# EAGLE design AODC v1 (EAGLE 6.1)
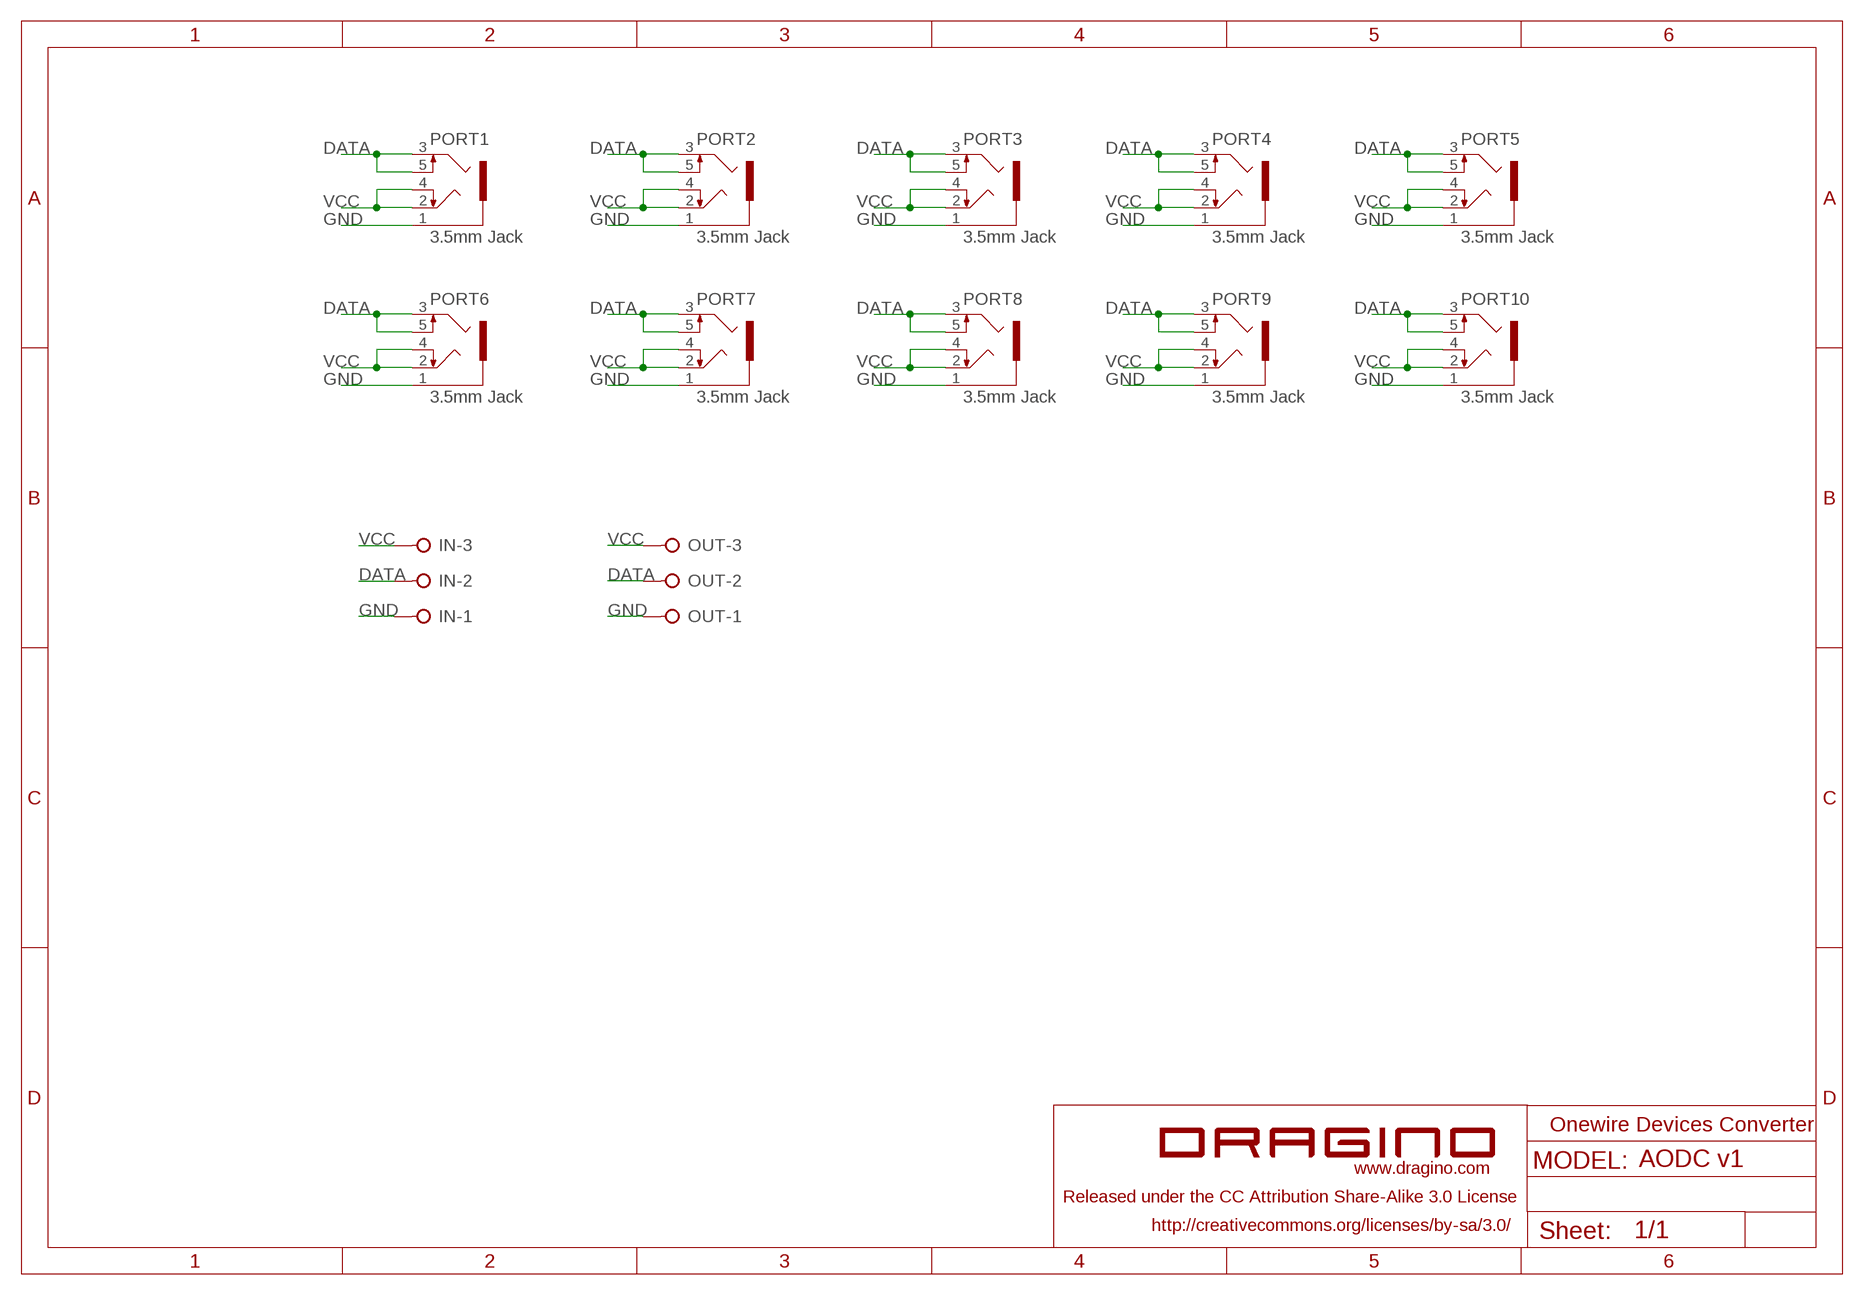
[diagram p0: schematic, sheet 1]

## Parts
IN  SCREW-TERMINAL-3P  [W237-3E]
OUT  SCREW-TERMINAL-3P  [W237-3E]
PORT1  3.5mm Jack  AUDIO-JACK-3.5MMAUDIO-3.5MM  [AUDIO-JACK-3.5MM]
PORT2  3.5mm Jack  AUDIO-JACK-3.5MMAUDIO-3.5MM  [AUDIO-JACK-3.5MM]
PORT3  3.5mm Jack  AUDIO-JACK-3.5MMAUDIO-3.5MM  [AUDIO-JACK-3.5MM]
PORT4  3.5mm Jack  AUDIO-JACK-3.5MMAUDIO-3.5MM  [AUDIO-JACK-3.5MM]
PORT5  3.5mm Jack  AUDIO-JACK-3.5MMAUDIO-3.5MM  [AUDIO-JACK-3.5MM]
PORT6  3.5mm Jack  AUDIO-JACK-3.5MMAUDIO-3.5MM  [AUDIO-JACK-3.5MM]
PORT7  3.5mm Jack  AUDIO-JACK-3.5MMAUDIO-3.5MM  [AUDIO-JACK-3.5MM]
PORT8  3.5mm Jack  AUDIO-JACK-3.5MMAUDIO-3.5MM  [AUDIO-JACK-3.5MM]
PORT9  3.5mm Jack  AUDIO-JACK-3.5MMAUDIO-3.5MM  [AUDIO-JACK-3.5MM]
PORT10  3.5mm Jack  AUDIO-JACK-3.5MMAUDIO-3.5MM  [AUDIO-JACK-3.5MM]
U$1  LOGO-SILK  [LOGO-SILK-15MM]

## Nets
DATA: IN.2 OUT.2 PORT1.3 PORT1.5 PORT2.3 PORT2.5 PORT3.3 PORT3.5 PORT4.3 PORT4.5 PORT5.3 PORT5.5 PORT6.3 PORT6.5 PORT7.3 PORT7.5 PORT8.3 PORT8.5 PORT9.3 PORT9.5 PORT10.3 PORT10.5
GND: IN.1 OUT.1 PORT1.1 PORT2.1 PORT3.1 PORT4.1 PORT5.1 PORT6.1 PORT7.1 PORT8.1 PORT9.1 PORT10.1
VCC: IN.3 OUT.3 PORT1.2 PORT1.4 PORT2.2 PORT2.4 PORT3.2 PORT3.4 PORT4.2 PORT4.4 PORT5.2 PORT5.4 PORT6.2 PORT6.4 PORT7.2 PORT7.4 PORT8.2 PORT8.4 PORT9.2 PORT9.4 PORT10.2 PORT10.4

## Notes on the sheet
- Onewire Devices Converter

## Library data of the parts
IN OUT = dragino:SCREW-TERMINAL-3P: WAGO SREW CLAMP; OC_FARNELL: unknown; OC_NEWARK: unknown
PORT1-PORT10 = dragino:AUDIO-JACK-3.5MM
U$1 = dragino:LOGO-SILK: LOGO for Dragino

## Net classes
0 default: width 0.254 mm, clearance 0.254 mm
1 power: width 0.61 mm, drill 0.61 mm, clearance 0.254 mm
2 gnd: width 0.305 mm, drill 0.381 mm, clearance 0.254 mm
3 usbvcc: width 0.508 mm, drill 0.61 mm, clearance 0.254 mm
4 aref: width 0.406 mm, drill 0.61 mm, clearance 0.254 mm

## Board
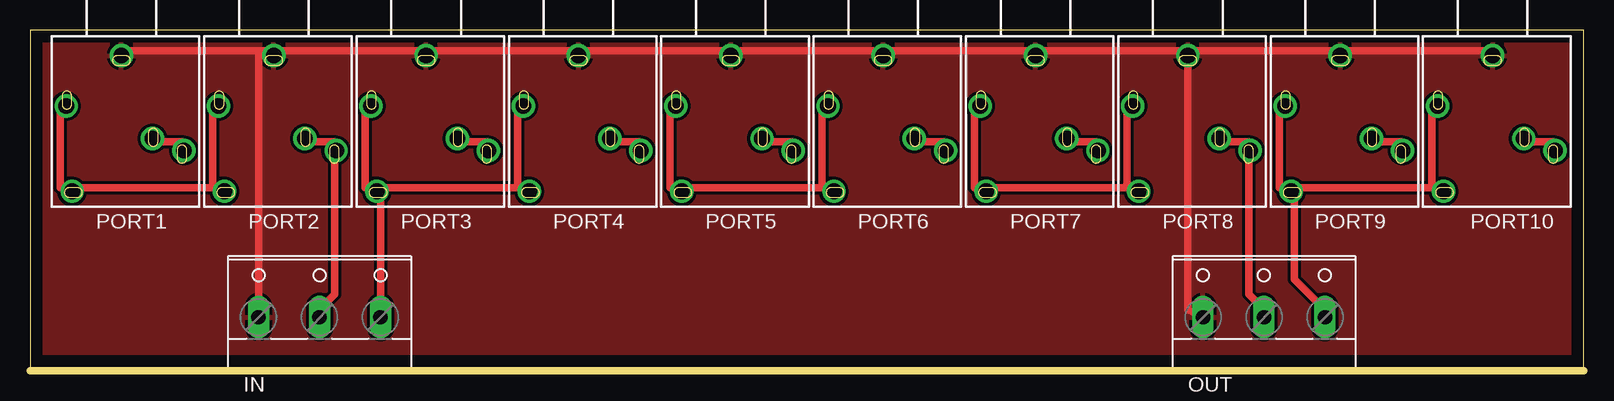
[diagram p1: board, top side]
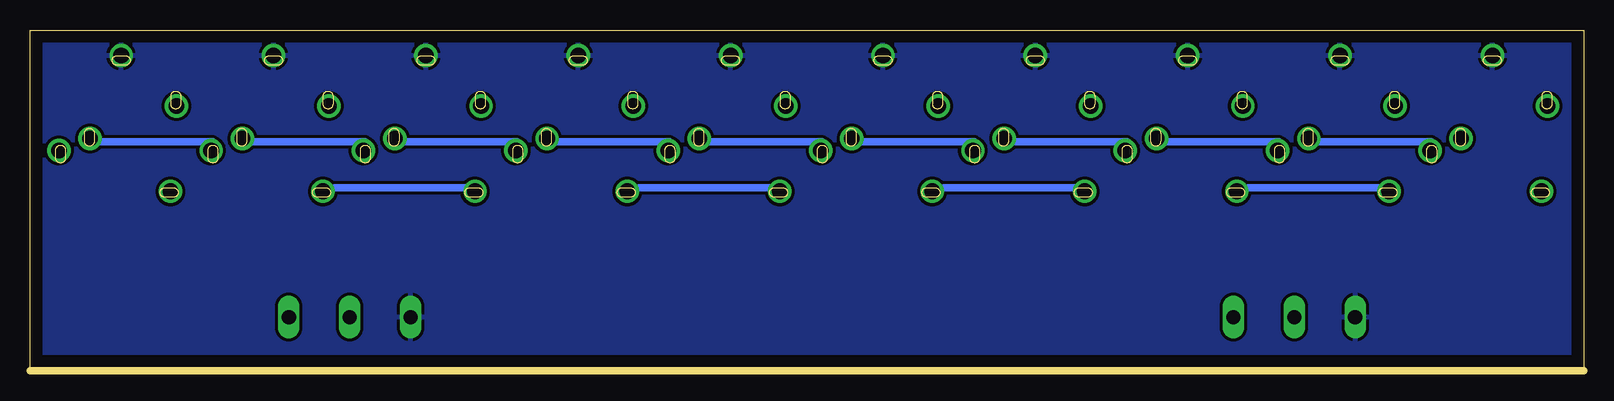
[diagram p2: board, bottom side, seen from below]

Size 129.52 x 28.38 mm. Coordinates in mm from the lower left corner, seen from the top.
Outline: 0,0 129.52,0 129.52,28.38 0,28.38 0,0
Copper layers (1*16): Top 0.035mm / dielectric 1.5mm / Bottom 0.035mm
Design rules: minimum track width 10mil, minimum drill 12mil, track to track 8mil, track to pad 8mil, pad to pad 8mil, via to via 10mil, smd to smd 8mil, copper to edge 40mil, drill to drill 8mil, minimum pad ring 10mil, minimum via ring 8mil, stop-mask expansion 4mil, vias tented up to drill 0mil, thermal gap 10mil

### Footprints (pad centres in the part's own frame; a part is rotated, then mirrored left to right if it is on the bottom)
W237-3E = drill 1.194 long: 1 -5.08,-0.635; 2 0,-0.635; 3 5.08,-0.635
AUDIO-JACK-3.5MM = drill 1.3: 1 0,-1.7; 2 -4.6,-5.9; 3 5.2,-9.6; 4 -4.1,-13; 5 2.6,-8.6

### Placement (x,y rotation side)
IN  24.13,5.08 0 top
OUT  102.87,5.08 0 top
PORT1  7.62,27.94 0 top
PORT2  20.32,27.94 0 top
PORT3  33.02,27.94 0 top
PORT4  45.72,27.94 0 top
PORT5  58.42,27.94 0 top
PORT6  71.12,27.94 0 top
PORT7  83.82,27.94 0 top
PORT8  96.52,27.94 0 top
PORT9  109.22,27.94 0 top
PORT10  121.92,27.94 0 top
U$1  57.15,8.89 0 top

### Tracks (layer width: path | path; a pad name or v marks a point on that pad's centre or on a via)
DATA
  Top 0.254: 101.6,19.05 PORT8.3
  Top 0.61: PORT3.3 38.1,19.05 35.56,19.05 PORT3.5 | PORT4.3 50.8,19.05 48.26,19.05 PORT4.5 | PORT1.3 12.7,19.05 10.16,19.05 PORT1.5 | PORT2.5 22.86,19.05 25.4,19.05 PORT2.3 25.4,17.78 25.4,6.35 24.13,5.08 IN.2 | PORT7.5 86.36,19.05 88.9,19.05 PORT7.3 | PORT5.3 63.5,19.05 60.96,19.05 PORT5.5 | PORT6.3 76.2,19.05 73.66,19.05 PORT6.5 | PORT10.5 124.46,19.05 127,19.05 PORT10.3 | PORT9.5 111.76,19.05 114.3,19.05 PORT9.3 | 101.6,19.05 99.06,19.05 PORT8.5 | OUT.2 102.87,5.08 101.6,6.35 101.6,17.78 PORT8.3
  Bottom 0.254: 35.56,19.05 PORT3.5 | 111.76,19.05 PORT9.5
  Bottom 0.61: PORT3.3 38.1,19.05 48.26,19.05 PORT4.5 | PORT1.3 12.7,19.05 22.86,19.05 PORT2.5 | 35.56,19.05 25.4,19.05 PORT2.3 | PORT5.3 63.5,19.05 73.66,19.05 PORT6.5 | PORT7.5 86.36,19.05 76.2,19.05 PORT6.3 | 111.76,19.05 101.6,19.05 PORT8.3 | PORT10.5 124.46,19.05 114.3,19.05 PORT9.3 | PORT7.3 88.9,19.05 99.06,19.05 PORT8.5 | PORT4.3 50.8,19.05 60.96,19.05 PORT5.5
GND
  Top 0.254: 20.32,26.67 PORT2.1 | 33.02,26.67 PORT3.1 | 45.72,26.67 PORT4.1 | 83.82,26.67 PORT7.1 | 109.22,26.67 PORT9.1 | 58.42,26.67 PORT5.1 58.42,26.67 | 71.12,26.67 PORT6.1 71.12,26.67 | 96.52,26.67 PORT8.1 96.52,26.67
  Top 0.61: 20.32,26.67 19.05,26.67 | 19.05,26.67 7.62,26.67 PORT1.1 | 20.32,26.67 33.02,26.67 | 20.32,26.67 PORT2.1 | 33.02,26.67 45.72,26.67 | 33.02,26.67 PORT3.1 | 45.72,26.67 58.42,26.67 71.12,26.67 83.82,26.67 | 45.72,26.67 PORT4.1 | 83.82,26.67 96.52,26.67 | 83.82,26.67 PORT7.1 | 96.52,26.67 109.22,26.67 | 109.22,26.67 121.92,26.67 PORT10.1 | 109.22,26.67 PORT9.1 | 19.05,26.67 19.05,5.08 IN.1 | 96.52,26.67 96.52,5.08 OUT.1
  pour Bottom: 0,27.94 129.54,27.94 129.54,0 0,0
  pour Top: 0,27.94 129.54,27.94 129.54,0 0,0
VCC
  Top 0.254: 116.84,15.24 PORT10.4 | 91.44,15.24 PORT8.4 | 105.41,15.24 PORT9.4 | 66.04,15.24 PORT6.4 | 15.24,15.24 PORT2.4 | 40.64,15.24 PORT4.4 | 29.21,15.24 PORT3.4 29.21,15.24
  Top 0.61: 116.84,15.24 116.84,21.59 PORT10.2 | 91.44,15.24 91.44,21.59 PORT8.2 | PORT9.2 104.14,21.59 104.14,15.24 PORT9.4 105.41,15.24 | 105.41,15.24 105.41,7.62 107.95,5.08 OUT.3 | 105.41,15.24 116.84,15.24 | 116.84,15.24 PORT10.4 | 66.04,15.24 66.04,21.59 PORT6.2 | PORT7.2 78.74,21.59 78.74,15.24 PORT7.4 80.01,15.24 91.44,15.24 | PORT1.2 2.54,21.59 2.54,15.24 PORT1.4 3.81,15.24 15.24,15.24 | 15.24,15.24 15.24,21.59 PORT2.2 | 15.24,15.24 PORT2.4 | PORT3.4 27.94,15.24 27.94,21.59 PORT3.2 | IN.3 29.21,5.08 29.21,15.24 40.64,15.24 | 40.64,15.24 40.64,21.59 PORT4.2 | PORT5.2 53.34,21.59 53.34,15.24 PORT5.4 54.61,15.24 66.04,15.24 | 40.64,15.24 PORT4.4 | 66.04,15.24 PORT6.4 | 91.44,15.24 PORT8.4
  Bottom 0.61: PORT8.4 92.71,15.24 104.14,15.24 PORT9.4 | PORT6.4 67.31,15.24 78.74,15.24 PORT7.4 | PORT4.4 41.91,15.24 53.34,15.24 PORT5.4 | PORT2.4 16.51,15.24 27.94,15.24 PORT3.4

### Text on the board
tDocu: GND | DATA | VCC | GND | DATA | VCC | Onewire Devices Converter | MODEL: AODC v1